# EAGLE design DFN-6_2x2 (EAGLE 9.6.2)
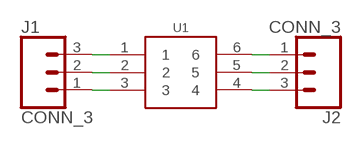
[diagram p0: schematic, sheet 1]

## Parts
J1  CONN_3  [1X03]
J2  CONN_3  [1X03]
U1  GEN_6DFN_2X2  [DFN_6_2X2]

## Nets
N$1: J1.1 U1.3
N$2: J1.2 U1.2
N$3: J1.3 U1.1
N$4: J2.3 U1.4
N$5: J2.2 U1.5
N$6: J2.1 U1.6

## Library data of the parts
J1 J2 = bschulz:CONN_3: Genaric 3 terminal header Digikey 2.54_SCREW <https://www.digikey.com/product-detail/en/on-shore-technology-inc/OSTVN03A150/ED10562-ND/1588863> 3.5_SCREW <https://www.digikey.com/product-detail/en/on-shore-technology-inc/OSTTE030161/ED2636-ND/614585>
U1 = bschulz:GEN_6: Generic 6 Pin Package for Breakout Boards

## Board
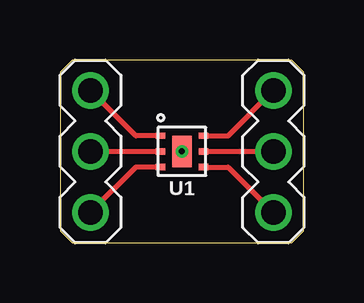
[diagram p1: board, top side]

Size 10.16 x 7.62 mm. Coordinates in mm from the lower left corner, seen from the top.
Outline: 0,7.12 0,0.5 0.5,0 9.66,0 10.16,0.5 10.16,7.12 9.66,7.62 0.5,7.62 0,7.12
Copper layers (1*16): Top 0.035559375mm / dielectric 1.6mm / Bottom 0.035559375mm
Design rules "oshpark-2layer": minimum track width 6mil, minimum drill 10mil, track to track 6mil, track to pad 6mil, pad to pad 6mil, via to via 6mil, smd to smd 6mil, copper to edge 15mil, drill to drill 6mil, minimum pad ring 5mil, minimum via ring 5mil, stop-mask expansion 2.5mil, vias tented up to drill 0mil, thermal gap 10mil

### Footprints (pad centres in the part's own frame; a part is rotated, then mirrored left to right if it is on the bottom)
1X03 = drill 1.016: 1 -2.54,0; 2 0,0; 3 2.54,0
DFN_6_2X2 = smd 0.26 x 0.4: 1 -0.65,-0.9; 2 0,-0.9; 3 0.65,-0.9; 4 0.65,0.9; 5 0,0.9; 6 -0.65,0.9 | smd 1.3 x 0.8: PAD 0,0 | drill 0.254 pad 0.305: PAD@1 0,0

### Placement (x,y rotation side)
J1  1.27,3.81 90 top
J2  8.89,3.81 270 top
U1  5.08,3.81 270 top

### Tracks (layer width: path | path; a pad name or v marks a point on that pad's centre or on a via)
N$1
  Top 0.2: U1.3 3.16,3.16 J1.1
N$2
  Top 0.2: J1.2 U1.2
N$3
  Top 0.2: U1.1 3.16,4.46 J1.3
N$4
  Top 0.2: U1.4 7,3.16 J2.3
N$5
  Top 0.2: U1.5 J2.2
N$6
  Top 0.2: U1.6 7,4.46 J2.1

### Text on the board
tDocu: DFN-6 | 1 | 6 | 2 | 5 | 3 | 4
bDocu: B. Schulz / Break44